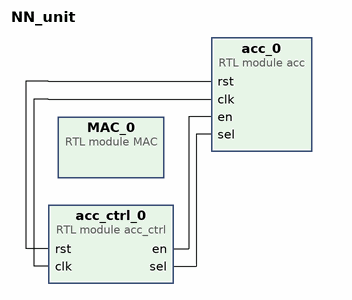
[diagram p0: block diagram of the top level]
# Vivado block design NN_unit, xc7k70tfbv676-1, Vivado 2022.1.2
create_bd_design NN_unit

create_bd_cell -type module -reference acc_ctrl acc_ctrl_0
create_bd_cell -type module -reference acc acc_0
create_bd_cell -type module -reference MAC MAC_0

# ---- connections ----

connect_bd_net [get_bd_pins acc_ctrl_0/rst] [get_bd_pins acc_0/rst]
connect_bd_net [get_bd_pins acc_ctrl_0/clk] [get_bd_pins acc_0/clk]
connect_bd_net [get_bd_pins acc_ctrl_0/en] [get_bd_pins acc_0/en]
connect_bd_net [get_bd_pins acc_ctrl_0/sel] [get_bd_pins acc_0/sel]

validate_bd_design
save_bd_design
